# EAGLE design 32u4 board (EAGLE 7.2.0)
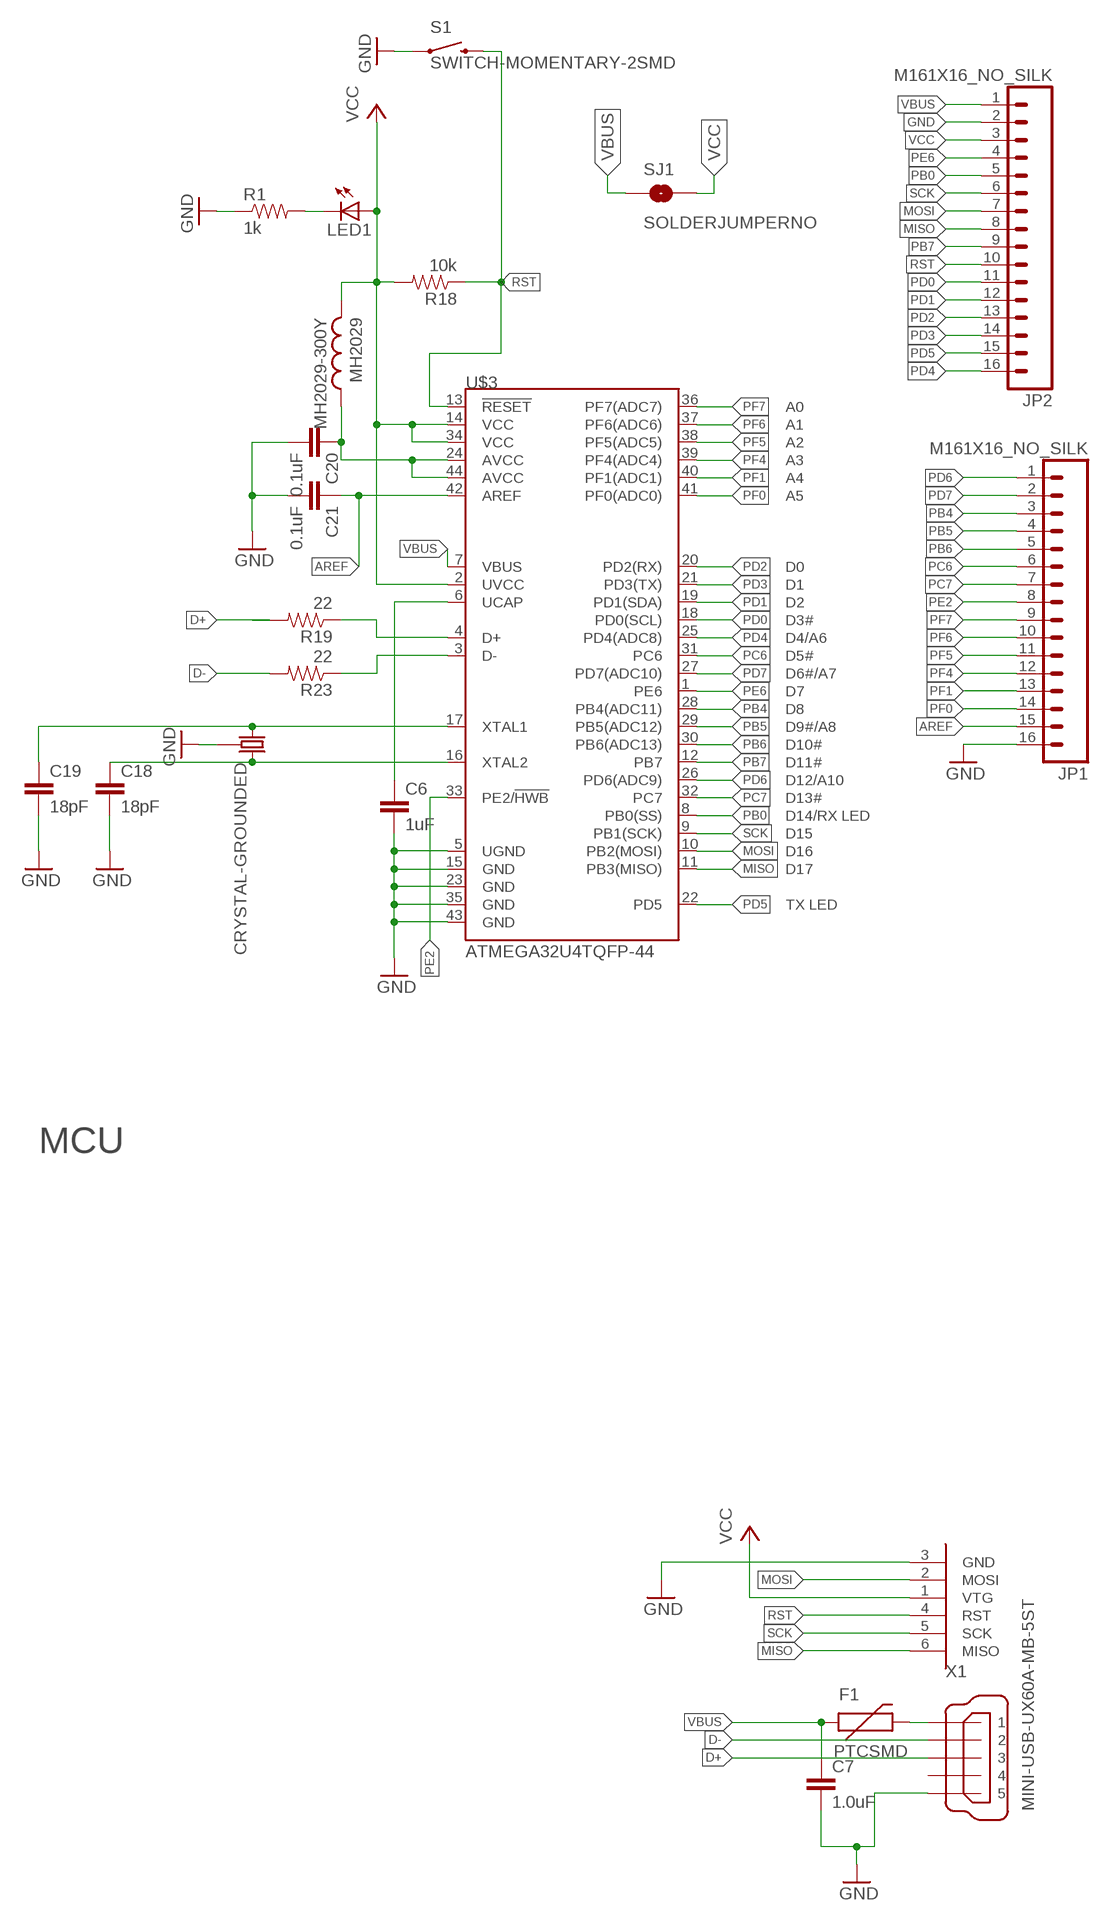
[diagram p0: schematic, sheet 1]

## Parts
C6  1uF  0.1UF-25V(+80/-20%)(0603)  [0603-CAP]
C7  1.0uF  1.0UF-16V-10%(0603)  [0603-CAP]
C18  18pF  0.1UF-25V(+80/-20%)(0603)  [0603-CAP]
C19  18pF  0.1UF-25V(+80/-20%)(0603)  [0603-CAP]
C20  0.1uF  0.1UF-25V(+80/-20%)(0603)  [0603-CAP]
C21  0.1uF  0.1UF-25V(+80/-20%)(0603)  [0603-CAP]
F1  PTCSMD  [PTC-1206]
JP1  M161X16_NO_SILK  [1X16_NO_SILK]
JP2  M161X16_NO_SILK  [1X16_NO_SILK]
LED1  LEDCHIPLED_0603  [CHIPLED_0603]
MH2029  MH2029-300Y  L-USL2012C  [L2012C]
R1  1k  RESISTOR0603  [0603-RES]
R18  10k  RESISTOR0603-RES  [0603-RES]
R19  22  RESISTOR0603-RES  [0603-RES]
R23  22  RESISTOR0603-RES  [0603-RES]
S1  SWITCH-MOMENTARY-2SMD  [TACTILE_SWITCH_SMD]
SJ1  SOLDERJUMPERNO  [SJ_2S-NO]
U$2  ICSP_SMD  [ICSP]
U$3  ATMEGA32U4TQFP-44  [TQFP44]
U$4  CRYSTAL-GROUNDED  [CRYSTAL-SMD-5X3]
X1  MINI-USB-UX60A-MB-5ST  [UX60A-MB-5ST]

## Nets
AREF: C21.1 JP1.15 U$3.42(AREF)
D+: R19.2 X1.3
D-: R23.2 X1.2
GND: C6.2 C7.2 C18.2 C19.2 C20.2 C21.2 JP1.16 JP2.2 R1.1 S1.1 U$2.3(GND) U$3.5(UGND) U$3.15(GND) U$3.23(GND) U$3.35(GND) U$3.43(GND) U$4.2 U$4.4 X1.5
MISO: JP2.8 U$2.6(MISO) U$3.11(PB3(MISO))
MOSI: JP2.7 U$2.2(MOSI) U$3.10(PB2(MOSI))
N$1: LED1.C R1.2
N$2: F1.2 X1.1
N$23: R19.1 U$3.4(D+)
N$24: R23.1 U$3.3(D-)
N$27: C6.1 U$3.6(UCAP)
N$31: C20.1 MH2029.1 U$3.24(AVCC) U$3.44(AVCC)
N$39: C19.1 U$3.17(XTAL1) U$4.3
N$41: C18.1 U$3.16(XTAL2) U$4.1
PB0: JP2.5 U$3.8(PB0(SS))
PB4: JP1.3 U$3.28(PB4(ADC11))
PB5: JP1.4 U$3.29(PB5(ADC12))
PB6: JP1.5 U$3.30(PB6(ADC13))
PB7: JP2.9 U$3.12(PB7)
PC6: JP1.6 U$3.31(PC6)
PC7: JP1.7 U$3.32(PC7)
PD0: JP2.11 U$3.18(PD0(SCL))
PD1: JP2.12 U$3.19(PD1(SDA))
PD2: JP2.13 U$3.20(PD2(RX))
PD3: JP2.14 U$3.21(PD3(TX))
PD4: JP2.16 U$3.25(PD4(ADC8))
PD5: JP2.15 U$3.22(PD5)
PD6: JP1.1 U$3.26(PD6(ADC9))
PD7: JP1.2 U$3.27(PD7(ADC10))
PE2: JP1.8 U$3.33(PE2/!HWB)
PE6: JP2.4 U$3.1(PE6)
PF0: JP1.14 U$3.41(PF0(ADC0))
PF1: JP1.13 U$3.40(PF1(ADC1))
PF4: JP1.12 U$3.39(PF4(ADC4))
PF5: JP1.11 U$3.38(PF5(ADC5))
PF6: JP1.10 U$3.37(PF6(ADC6))
PF7: JP1.9 U$3.36(PF7(ADC7))
RST: JP2.10 R18.1 S1.3 U$2.4(RST) U$3.13(!RESET)
SCK: JP2.6 U$2.5(SCK) U$3.9(PB1(SCK))
VBUS: C7.1 F1.1 JP2.1 SJ1.1 U$3.7(VBUS)
VCC: JP2.3 LED1.A MH2029.2 R18.2 SJ1.2 U$2.1(VTG) U$3.2(UVCC) U$3.14(VCC) U$3.34(VCC)
Unconnected: X1.4

## Notes on the sheet
- MCU

## Library data of the parts
C6 C18 C19 = SparkFun-Capacitors:0.1UF-25V(+80/-20%)(0603): Ceramic Standard decoupling cap CAP-00810; PROD_ID: CAP-00810; VALUE: 0.1uF
C7 = SparkFun-Capacitors:1.0UF-16V-10%(0603): CAP-00868; PROD_ID: CAP-00868
C20 C21 = SparkFun-Capacitors:0.1UF-25V(+80/-20%)(0603): Ceramic Standard decoupling cap CAP-00810; PROD_ID: CAP-00810
F1 = SparkFun-PowerIC:PTC: Resettable Fuse PTC Resettable Fuse. Spark Fun Electronics SKU : COM-08357; PROD_ID: RES-11150
JP1 JP2 = SparkFun-Connectors:M16: 1x16 .1" header
LED1 = adafruit:LED: LED OSRAM: - CHIPLED LG R971, LG N971, LY N971, LG Q971, LY Q971, LO R971, LY R971 LH N974, LH R974 LS Q976, LO Q976, LY Q976 LO Q996 - Hyper CHIPLED LW Q18S LB Q993, LB Q99A, LB R99A - SideLED LS A670, LO A670, LY A670, LG A670, LP A670 LB A673, LV A673, LT A673, LW A673 LH A674 LY A675 LS A676, LA A676, LO A676, LY A676, LW A676 LS A679, LY A679, LG A679 - Hyper Micro SIDELED® LS Y876, LA Y876, LO Y876, LY Y876 LT Y87S - SmartLED LW L88C, LW L88S LB L89C, LB L89S, LG L890 LS L89K, LO L89K, LY L89K LS L896, LA L896, LO L896, LY L896 - TOPLED LS T670, LO T670, LY T670, LG T670, LP T670 LSG T670, LSP T670, LSY T670, LOP T670, LYG T670 LG T671, LOG T671, LSG T671 LB T673, LV T673, LT T673, LW T673 LH T674 LS T676, LA T676, LO T676, LY T676, LB T676, LH T676, LSB T676, LW T676 LB T67C, LV T67C, LT T67C, LS T67K, LO T67K, LY T67K, LW E67C LS E67B, LA E67B, LO E67B, LY E67B, LB E67C, LV E67C, LT E67C LW T67C LS T679, LY T679, LG T679 LS T770, LO T770, LY T770, LG T770, LP T770 LB T773, LV T773, LT T773, LW T773 LH T774 LS E675, LA E675, LY E675, LS T675 LS T776, LA T776, LO T776, LY T776, LB T776 LHGB T686 LT T68C, LB T68C - Hyper Mini TOPLED® LB M676 - Mini TOPLED Santana® LG M470 LS M47K, LO M47K, LY M47K Source: http://www.osram.convergy.de/
MH2029 = resistor:L-US: INDUCTOR, American symbol
R1 = SparkFun-Resistors:RESISTOR: Resistor Basic schematic elements and footprints for 0603, 1206, and PTH resistors.
R18 R19 R23 = SparkFun-Passives:RESISTOR: Resistor Basic schematic elements and footprints for 0603, 1206, and PTH resistors.
S1 = SparkFun-Electromechanical:SWITCH-MOMENTARY-2: Various NO switches- pushbuttons, reed, etc
SJ1 = SparkFun-Retired:SOLDERJUMPER: Solder Jumper Standard SMD solder jumper. Used to automate production. Two varients : Normally Open and Normally Closed are the same, but have different paste layers. NC will have a large amount of paste and should jumper during reflow.
U$2 = Jake:ICSP_SMD
U$3 = SparkFun-DigitalIC:ATMEGA32U4: Atmel 44-pin 8-bit Microcontroller with 32KBytes of ISP Flash and USB Controller
U$4 = SparkFun-FreqCtrl:CRYSTAL-GROUNDED
X1 = con-hirose:MINI-USB-: MINI USB Connector Source: http://www.hirose.co.jp/cataloge_hp/e24000019.pdf; OC_FARNELL: unknown; OC_NEWARK: unknown

## Board
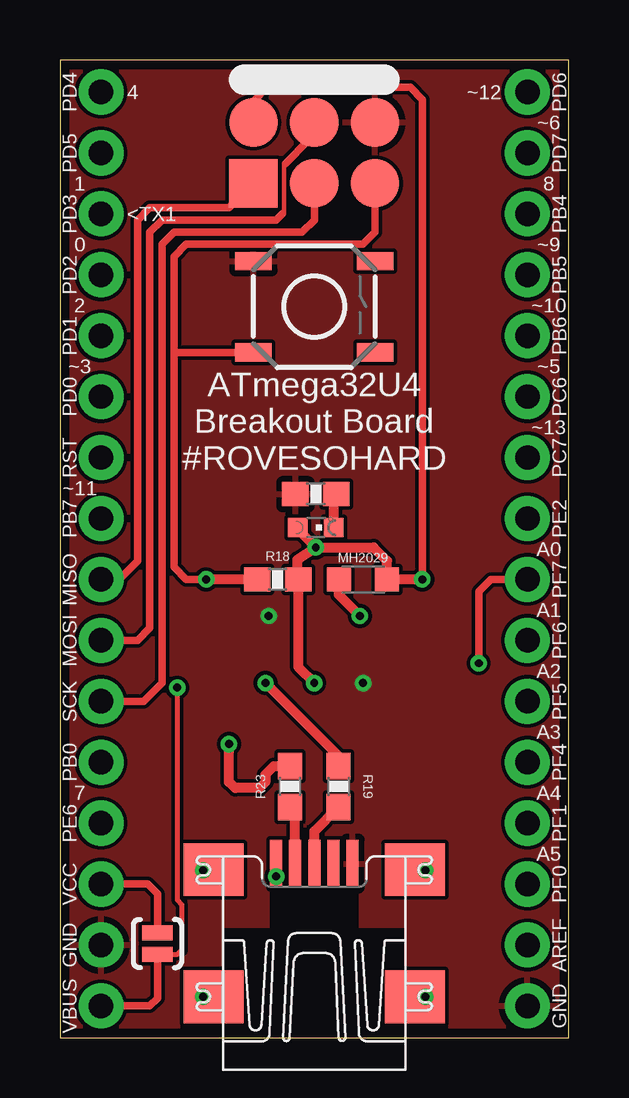
[diagram p1: board, top side]
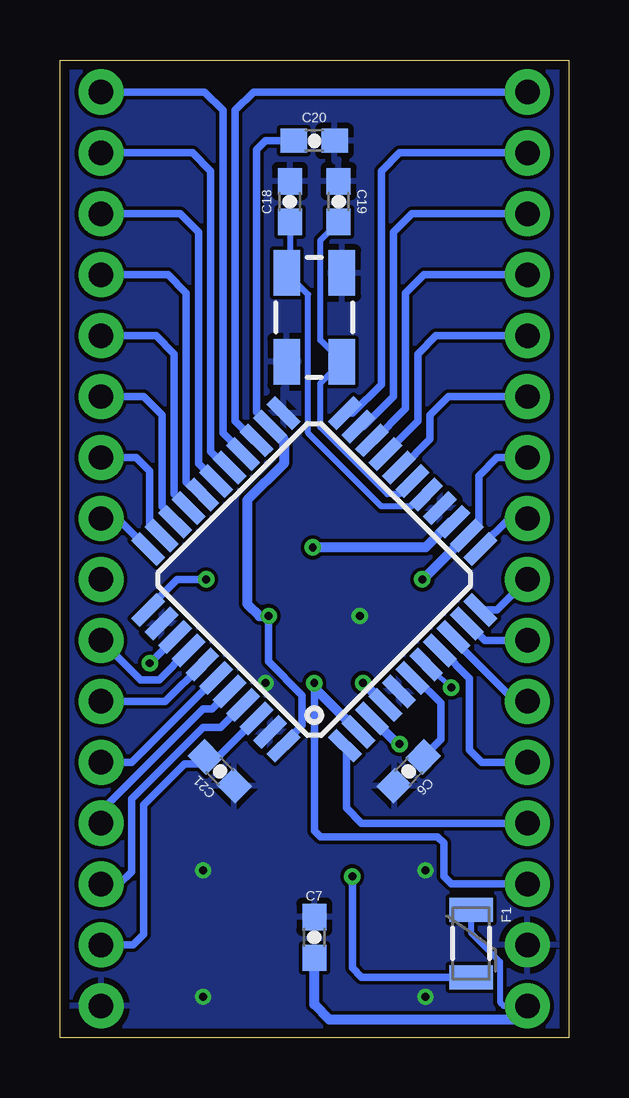
[diagram p2: board, bottom side, seen from below]

Size 21.21 x 40.77 mm. Coordinates in mm from the lower left corner, seen from the top.
Outline: 0,0 21.21,0 21.21,40.77 0,40.77 0,0
Copper layers (1*16): Top 0.0356mm / dielectric 1.5011mm / Bottom 0.0356mm
Design rules "LaenPCBOrder": minimum track width 6mil, minimum drill 13mil, track to track 6mil, track to pad 6mil, pad to pad 6mil, via to via 6mil, smd to smd 6mil, copper to edge 15mil, drill to drill 6mil, minimum pad ring 7mil, minimum via ring 7mil, stop-mask expansion 3mil, vias tented up to drill 0mil, thermal gap 10mil

### Footprints (pad centres in the part's own frame; a part is rotated, then mirrored left to right if it is on the bottom)
0603-CAP = smd 1.1 x 1: 1 -0.85,0; 2 0.85,0
PTC-1206 = smd 1 x 1.8: 1 -1.4,0; 2 1.4,0
1X16_NO_SILK = drill 1.016 pad 1.88: 1 0,0; 2 2.54,0; 3 5.08,0; 4 7.62,0; 5 10.16,0; 6 12.7,0; 7 15.24,0; 8 17.78,0; 9 20.32,0; 10 22.86,0; 11 25.4,0; 12 27.94,0; 13 30.48,0; 14 33.02,0; 15 35.56,0; 16 38.1,0
CHIPLED_0603 = smd 0.8 x 0.8: A 0,-0.75; C 0,0.75
L2012C = smd 1 x 1: 1 -1,0; 2 1,0
0603-RES = smd 1.1 x 1: 1 -0.85,0; 2 0.85,0
TACTILE_SWITCH_SMD = smd 1.524 x 0.762: 1 -2.54,1.905; 2 2.54,1.905; 3 -2.54,-1.905; 4 2.54,-1.905
SJ_2S-NO = smd 0.635 x 1.27: 1 -0.45,0; 2 0.45,0
ICSP = smd 2.032 x 2.032: 1 -2.54,1.27; 2 0,1.27; 3 2.54,1.27; 4 2.54,-1.27; 5 0,-1.27; 6 -2.54,-1.27
TQFP44 = smd 1.5 x 0.5: 1 -5.8,4; 2 -5.8,3.2; 3 -5.8,2.4; 4 -5.8,1.6; 5 -5.8,0.8; 6 -5.8,0; 7 -5.8,-0.8; 8 -5.8,-1.6; 9 -5.8,-2.4; 10 -5.8,-3.2; 11 -5.8,-4; 23 5.8,-4; 24 5.8,-3.2; 25 5.8,-2.4; 26 5.8,-1.6; 27 5.8,-0.8; 28 5.8,0; 29 5.8,0.8; 30 5.8,1.6; 31 5.8,2.4; 32 5.8,3.2; 33 5.8,4 | smd 0.5 x 1.5: 12 -4,-5.8; 13 -3.2,-5.8; 14 -2.4,-5.8; 15 -1.6,-5.8; 16 -0.8,-5.8; 17 0,-5.8; 18 0.8,-5.8; 19 1.6,-5.8; 20 2.4,-5.8; 21 3.2,-5.8; 22 4,-5.8; 34 4,5.8; 35 3.2,5.8; 36 2.4,5.8; 37 1.6,5.8; 38 0.8,5.8; 39 0,5.8; 40 -0.8,5.8; 41 -1.6,5.8; 42 -2.4,5.8; 43 -3.2,5.8; 44 -4,5.8
CRYSTAL-SMD-5X3 = smd 1.9 x 1.1: 1 -1.85,-1.15; 2 1.85,-1.15; 3 1.85,1.15; 4 -1.85,1.15
UX60A-MB-5ST = smd 2 x 0.5: 1 2.25,1.6; 2 2.25,0.8; 3 2.25,0; 4 2.25,-0.8; 5 2.25,-1.6 | smd 2.2 x 2.5: M1 -3.3,-4.2; M2 -3.3,4.2; M3 2,4.2; M4 2,-4.2

### Placement (x,y rotation side)
C6  6.67,11.11 225 bottom
C7  10.6,4.19 90 bottom
C18  11.62,34.86 90 bottom
C19  9.59,34.86 90 bottom
C20  10.6,37.4 0 bottom
C21  14.54,11.11 315 bottom
F1  4.06,3.94 270 bottom
JP1  19.49,39.43 270 top
JP2  1.71,1.33 90 top
LED1  10.67,21.27 270 top
MH2029  12.64,19.11 0 top
R1  10.67,22.67 0 top
R18  9.08,19.11 0 top
R19  11.62,10.48 270 top
R23  9.59,10.48 270 top
S1  10.6,30.48 0 top
SJ1  4.06,3.94 90 top
U$2  10.6,36.89 0 top
U$3  10.6,19.11 135 bottom
U$4  10.6,30.04 270 bottom
X1  10.6,5.02 90 top

### Tracks (layer width: path | path; a pad name or v marks a point on that pad's centre or on a via)
AREF
  Bottom 0.305: JP1.15 18.16,3.87 17.72,4.32 17.72,9.72 16,11.43 15.43,11.43 C21.1 | C21.1 15.08,11.59 | C21.1 14.76,11.56 U$3.42
D+
  Top 0.406: X1.3 10.6,8.61 R19.2
D-
  Top 0.406: X1.2 9.8,9.41 R23.2
GND  (via drill 0.33)
  other vias: 5.97,1.71 5.97,6.99 15.24,6.99 15.24,1.71 12.64,14.8 8.7,17.59
  pour Bottom: -5.33,-2.03 31.11,-1.71 30.99,50.8 -5.33,50.8
  pour Top: -6.1,51.56 31.75,51.56 31.88,-2.48 -6.03,-2.79
MISO
  Top 0.305: JP2.8 2.48,19.11 3.24,19.88 3.24,34.1 3.75,34.61 7.05,34.61 U$2.6
  Bottom 0.305: U$3.11 2.99,17.84 JP2.8
MOSI
  Top 0.178: 9.4,36.45 9.34,36.39 9.34,34.42 9.27,34.35
  Top 0.305: U$2.2 10.35,38.16 10.35,37.4 9.4,36.45 | JP2.7 3.24,16.57 3.75,17.08 3.75,33.59 4.25,34.1 9.02,34.1 9.27,34.35
  Bottom 0.305: U$3.10 4.19,17.27 3.49,16.57 JP2.7
N$1
  Top 0.406: LED1.C 11.42,22.57 R1.2
N$2  (via drill 0.33)
  Top 0.305: X1.1 9.01,6.87 v9.02,6.73
  Bottom 0.305: F1.2 8.63,2.54 9.02,2.92 v9.02,6.73
N$23  (via drill 0.33)
  Top 0.406: R19.1 11.62,11.75 v8.57,14.8
  Bottom 0.406: v8.57,14.8 8.29,14.54 U$3.4
N$24  (via drill 0.33)
  Top 0.406: R23.1 8.91,11.33 8.57,10.99 8.57,10.67 8.32,10.41 7.3,10.41 7.05,10.67 v7.05,12.26
  Bottom 0.406: v7.05,12.26 7.14,12.26 U$3.3
N$27
  Bottom 0.305: U$3.6 6.38,15.01 5.33,13.97 5.33,12.45 C6.1
N$31  (via drill 0.33)
  Top 0.406: MH2029.1 11.62,19.1 11.62,18.48 v12.51,17.59
  Bottom 0.305: 11.88,12.25 11.11,13.02 11.11,14.29 12.51,15.68 v12.51,17.59 | U$3.24 12.44,25.52 13.02,26.1 13.02,37.02 12.64,37.4 C20.1
  Bottom 0.406: U$3.44 11.88,12.25 | U$3.24 12.4,25.48 11.87,24.96 11.87,23.94 13.4,22.42 13.4,18.1 12.89,17.59 v12.51,17.59
N$39
  Bottom 0.254: U$3.17 7.05,22.67 7.56,22.67 10.35,25.46 10.35,27.29 U$4.3 10.35,29.08 10.35,33.25 C19.1
N$41
  Bottom 0.254: U$3.16 6.05,22.65 6.54,22.16 7.81,22.16 10.86,25.21 10.86,30.99 U$4.1 11.62,31.77 C18.1
PB0
  Bottom 0.305: JP2.5 3.62,11.49 4.13,12 4.13,14.99 5.29,16.14 U$3.8
PB4
  Bottom 0.305: U$3.28 15.43,23.94 15.43,33.59 16.19,34.35 JP1.3
PB5
  Bottom 0.305: U$3.29 15.41,22.65 15.94,23.18 15.94,31.05 16.7,31.81 JP1.4
PB6
  Bottom 0.305: U$3.30 15.86,22.08 16.45,22.67 16.45,28.51 17.21,29.27 JP1.5
PB7
  Bottom 0.305: U$3.12 3.67,20.45 2.48,21.65 JP2.9
PC6
  Bottom 0.305: U$3.31 16.4,21.61 16.95,22.16 16.95,25.97 17.72,26.73 JP1.6
PC7
  Bottom 0.305: U$3.32 17.02,20.95 17.46,21.4 17.46,23.62 18.03,24.19 JP1.7
PD0
  Bottom 0.305: U$3.18 6.95,23.78 5.78,24.96 5.78,25.97 5.02,26.73 JP2.11
PD1
  Bottom 0.305: U$3.19 7.63,24.37 6.29,25.72 6.29,28.51 5.52,29.27 JP2.12
PD2
  Bottom 0.305: U$3.20 8.11,24.91 6.79,26.23 6.79,31.05 6.03,31.81 JP2.13
PD3
  Bottom 0.305: U$3.21 8.56,25.48 7.3,26.73 7.3,33.59 6.54,34.35 JP2.14
PD4
  Bottom 0.305: U$3.25 13.1,24.91 13.91,25.72 13.91,38.67 13.14,39.43 JP2.16
PD5
  Bottom 0.305: U$3.22 9.01,26.04 7.81,27.24 7.81,36.13 7.05,36.89 JP2.15
PD6
  Bottom 0.305: U$3.26 13.57,24.37 14.41,25.21 14.41,38.67 15.18,39.43 JP1.1
PD7
  Bottom 0.305: U$3.27 14.26,23.78 14.92,24.45 14.92,36.13 15.68,36.89 JP1.2
PE2
  Bottom 0.305: JP1.8 18.8,21.65 U$3.33
PE6
  Bottom 0.305: U$3.1 9.26,12.18 9.26,9.58 8.64,8.95 JP2.4
PF0
  Bottom 0.305: 13.57,13.86 U$3.41 14.5,12.95 15.24,12.95 18.22,9.97 18.22,6.92 18.73,6.41 JP1.14
PF1
  Bottom 0.305: 14.14,14.31 U$3.40 14.87,13.72 15.24,13.72 19.49,9.46 JP1.13
PF4
  Bottom 0.305: JP1.12 18.22,11.49 U$3.39
PF5
  Bottom 0.305: JP1.11 16.82,14.03 U$3.38
PF6
  Bottom 0.305: U$3.37 15.86,16.14 17.08,14.92 17.84,14.92 JP1.10
PF7  (via drill 0.33)
  Top 0.305: JP1.9 17.97,19.11 17.46,18.61 v17.46,15.62
  Bottom 0.305: U$3.36 16.4,16.68 v17.46,15.62
RST  (via drill 0.33)
  Top 0.305: U$2.4 13.14,33.59 12.64,33.08 5.27,33.08 4.76,32.58 4.76,28.57 | 4.76,28.57 4.76,19.62 5.27,19.11 v6.1,19.11 | S1.3 4.76,28.57
  Top 0.406: R18.1 v6.1,19.11
  Bottom 0.305: U$3.13 4.19,20.95 3.75,21.4 3.75,23.43 2.98,24.19 JP2.10
  Bottom 0.406: v6.1,19.11 6.08,19.11 U$3.13
SCK
  Top 0.305: U$2.5 10.6,34.1 10.1,33.59 4.76,33.59 4.25,33.08 4.25,14.8 3.49,14.03 JP2.6
  Bottom 0.305: U$3.9 4.81,16.62 2.22,14.03 JP2.6
VBUS  (via drill 0.33)
  Top 0.203: v4.89,14.61 4.89,5.75 5.08,5.56 5.08,3.65 4.92,3.49 SJ1.1
  Top 0.305: SJ1.1 4.06,1.65 3.75,1.33 JP2.1
  Bottom 0.203: 5.93,15.58 v4.89,14.61
  Bottom 0.254: F1.1 4.06,4.38 2.86,3.17 2.86,1.49 2.7,1.33 JP2.1
  Bottom 0.305: U$3.7 5.93,15.58
  Bottom 0.406: JP2.1 2.29,0.76 9.97,0.76 10.6,1.4 C7.1
VCC  (via drill 0.33)
  Top 0.305: U$2.1 8.06,39.05 8.64,39.62 14.61,39.62 15.11,39.12 v15.11,19.11 | SJ1.2 4.06,6 3.65,6.41 JP2.3
  Top 0.406: v15.11,19.11 MH2029.2 13.64,19.89 13.08,20.45 v10.67,20.45 | v10.67,20.45 9.91,19.94 9.91,19.14 R18.2 9.93,15.47 v10.6,14.8 | LED1.A 9.92,21.2 v10.67,20.45
  Bottom 0.305: 17.46,17.84 U$3.34 17.53,17.9 16.32,19.11 v15.11,19.11 | U$3.2 8.77,12.7 | JP2.3 4.89,6.41 5.21,6.73 5.21,8.13 5.46,8.38 10.35,8.38 10.6,8.64 10.6,14.73
  Bottom 0.406: 8.81,12.75 U$3.2 10.6,14.59 10.6,14.73 v10.6,14.8 | U$3.14 4.9,21.52 5.97,20.45 v10.67,20.45

### Text on the board
tNames: PD4 | 4 | ~12 | PD6 | ~6 | PD5 | PD7 | 1 | 8 | PD3 | <TX1 | PB4 | 0 | ~9 | PD2 | PB5 | 2 | ~10 | PD1 | PB6 | ~3 | ~5 | PD0 | PC6 | ATmega32U4 / Breakout Board / #ROVESOHARD | ~13 | RST | PC7 | ~11 | PB7 | PE2 | A0 | MISO | PF7 | A1 | MOSI | PF6 | A2 | SCK | PF5 | A3 | PB0 | PF4 | 7 | A4 | PE6 | PF1 | A5 | VCC | PF0 | GND | AREF | VBUS | GND